# EAGLE schematic Mem Switch V1.1 (EAGLE 9.6.2)

## Sheet 1 of 3: BUS
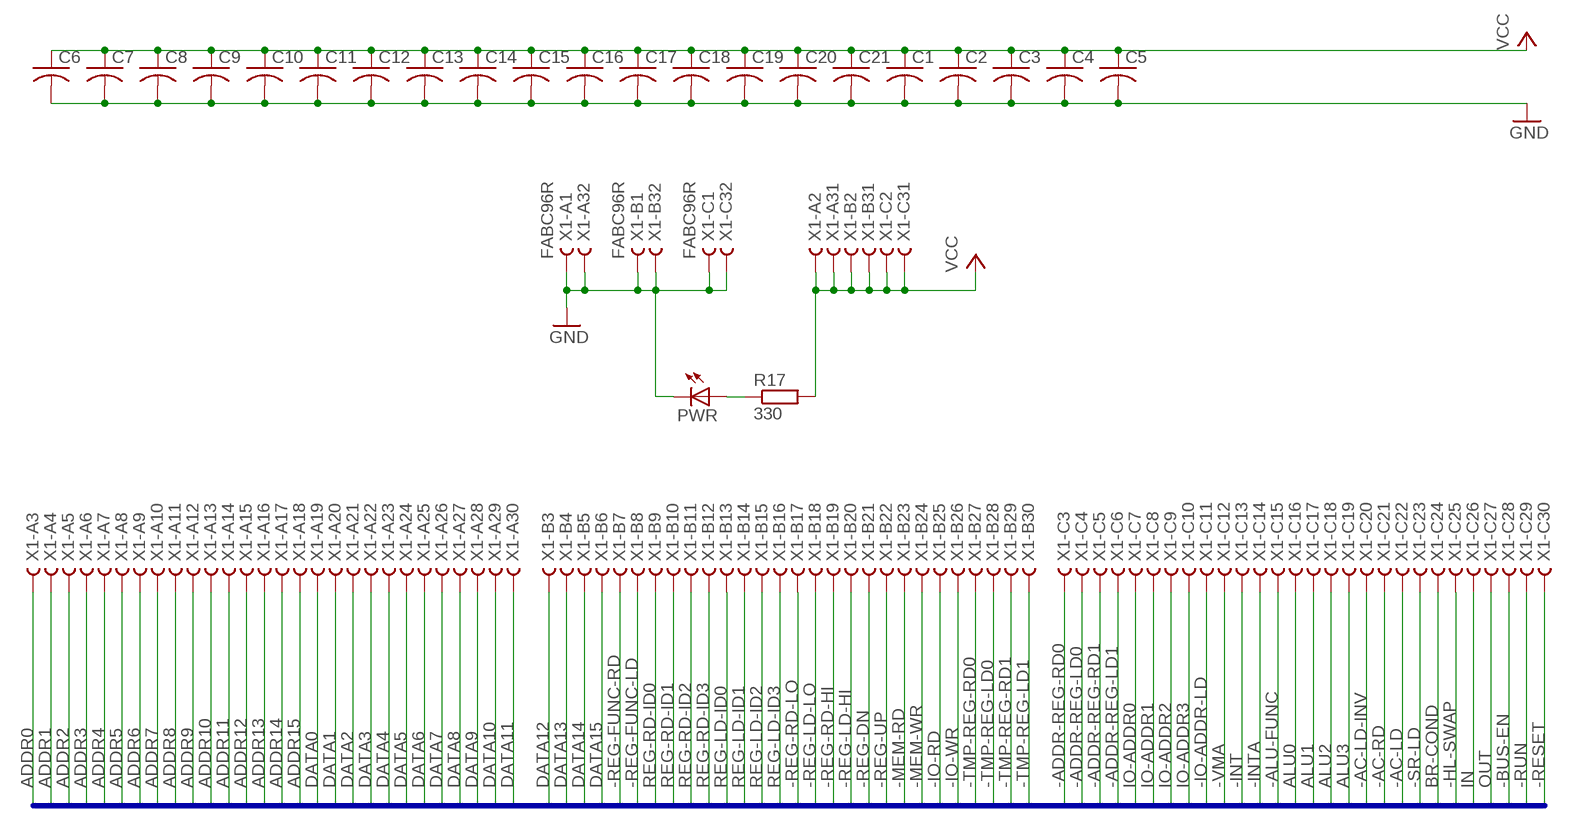
[diagram p0: schematic, sheet 1]

### Parts
C1  C-US025-025X050  [C025-025X050]
C2  C-US025-025X050  [C025-025X050]
C3  C-US025-025X050  [C025-025X050]
C4  C-US025-025X050  [C025-025X050]
C5  C-US025-025X050  [C025-025X050]
C6  C-US025-025X050  [C025-025X050]
C7  C-US025-025X050  [C025-025X050]
C8  C-US025-025X050  [C025-025X050]
C9  C-US025-025X050  [C025-025X050]
C10  C-US025-025X050  [C025-025X050]
C11  C-US025-025X050  [C025-025X050]
C12  C-US025-025X050  [C025-025X050]
C13  C-US025-025X050  [C025-025X050]
C14  C-US025-025X050  [C025-025X050]
C15  C-US025-025X050  [C025-025X050]
C16  C-US025-025X050  [C025-025X050]
C17  C-US025-025X050  [C025-025X050]
C18  C-US025-025X050  [C025-025X050]
C19  C-US025-025X050  [C025-025X050]
C20  C-US025-025X050  [C025-025X050]
C21  C-US025-025X050  [C025-025X050]
PWR  LED5MM  [LED5MM]
R17  330  R0207/10  [0207/10]
X1  FABC96R  [FABC96R]

### Nets
-AC-LD: X1.C22
-AC-LD-INV: X1.C20
-AC-RD: X1.C21
-ADDR-REG-LD0: X1.C4
-ADDR-REG-LD1: X1.C6
-ADDR-REG-RD0: X1.C3
-ADDR-REG-RD1: X1.C5
-ALU-FUNC: X1.C15
-BUS-EN: X1.C28 ; also sheet 3
-HL-SWAP: X1.C25
-INT: X1.C13
-INTA: X1.C14
-IO-ADDR-LD: X1.C11
-IO-RD: X1.B25
-IO-WR: X1.B26
-MEM-RD: X1.B23 ; also sheet 3
-MEM-WR: X1.B24
-REG-DN: X1.B21
-REG-FUNC-LD: X1.B8
-REG-FUNC-RD: X1.B7
-REG-LD-HI: X1.B20
-REG-LD-LO: X1.B18
-REG-RD-HI: X1.B19
-REG-RD-LO: X1.B17
-REG-UP: X1.B22
-RESET: X1.C30
-RUN: X1.C29
-SR-LD: X1.C23
-TMP-REG-LD0: X1.B28
-TMP-REG-LD1: X1.B30
-TMP-REG-RD0: X1.B27
-TMP-REG-RD1: X1.B29
-VMA: X1.C12 ; also sheet 3
ADDR0: X1.A3 ; also sheet 3
ADDR1: X1.A4 ; also sheet 3
ADDR2: X1.A5 ; also sheet 3
ADDR3: X1.A6 ; also sheet 3
ADDR4: X1.A7 ; also sheet 3
ADDR5: X1.A8 ; also sheet 3
ADDR6: X1.A9 ; also sheet 3
ADDR7: X1.A10 ; also sheet 3
ADDR8: X1.A11 ; also sheet 3
ADDR9: X1.A12 ; also sheet 3
ADDR10: X1.A13 ; also sheet 3
ADDR11: X1.A14 ; also sheet 3
ADDR12: X1.A15 ; also sheet 3
ADDR13: X1.A16 ; also sheet 3
ADDR14: X1.A17 ; also sheet 3
ADDR15: X1.A18 ; also sheet 3
ALU0: X1.C16
ALU1: X1.C17
ALU2: X1.C18
ALU3: X1.C19
BR-COND: X1.C24
DATA0: X1.A19 ; also sheet 2
DATA1: X1.A20 ; also sheet 2
DATA2: X1.A21 ; also sheet 2
DATA3: X1.A22 ; also sheet 2
DATA4: X1.A23 ; also sheet 2
DATA5: X1.A24 ; also sheet 2
DATA6: X1.A25 ; also sheet 2
DATA7: X1.A26 ; also sheet 2
DATA8: X1.A27
DATA9: X1.A28
DATA10: X1.A29
DATA11: X1.A30
DATA12: X1.B3
DATA13: X1.B4
DATA14: X1.B5
DATA15: X1.B6
GND: C1.2 C2.2 C3.2 C4.2 C5.2 C6.2 C7.2 C8.2 C9.2 C10.2 C11.2 C12.2 C13.2 C14.2 C15.2 C16.2 C17.2 C18.2 C19.2 C20.2 C21.2 PWR.K(C) X1.A1 X1.A32 X1.B1 X1.B32 X1.C1 X1.C32 ; also sheet 2,3
IN: X1.C26
IO-ADDR0: X1.C7
IO-ADDR1: X1.C8
IO-ADDR2: X1.C9
IO-ADDR3: X1.C10
N$11: PWR.A R17.1
OUT: X1.C27
REG-LD-ID0: X1.B13
REG-LD-ID1: X1.B14
REG-LD-ID2: X1.B15
REG-LD-ID3: X1.B16
REG-RD-ID0: X1.B9
REG-RD-ID1: X1.B10
REG-RD-ID2: X1.B11
REG-RD-ID3: X1.B12
VCC: C1.1 C2.1 C3.1 C4.1 C5.1 C6.1 C7.1 C8.1 C9.1 C10.1 C11.1 C12.1 C13.1 C14.1 C15.1 C16.1 C17.1 C18.1 C19.1 C20.1 C21.1 R17.2 X1.A2 X1.A31 X1.B2 X1.B31 X1.C2 X1.C31 ; also sheet 2,3

### Buses
-AC-LD,-AC-LD-INV,-AC-RD,ADDR[0..15],-ADDR-REG-LD[0..1],-ADDR-REG-RD[0..1],ALU[0..3],-ALU-FUNC,BR-COND,-BUS-EN,DATA[0..15],-HL-SWAP,IN,-INT,-INTA,IO-ADDR[0..3],-IO-ADDR-LD,-IO-RD,-IO-WR,-MEM-RD,-MEM-WR,OUT,-REG-DN,-REG-FUNC-LD,-REG-FUNC-RD,-REG-LD-HI,REG-LD-ID[0..3],-REG-LD-LO,-REG-RD-HI,REG-RD-ID[0..3],-REG-RD-LO,-REG-UP,-RESET,-RUN,-SR-LD,-TMP-REG-LD[0..1],-TMP-REG-RD[0..1],-VMA

## Sheet 2 of 3
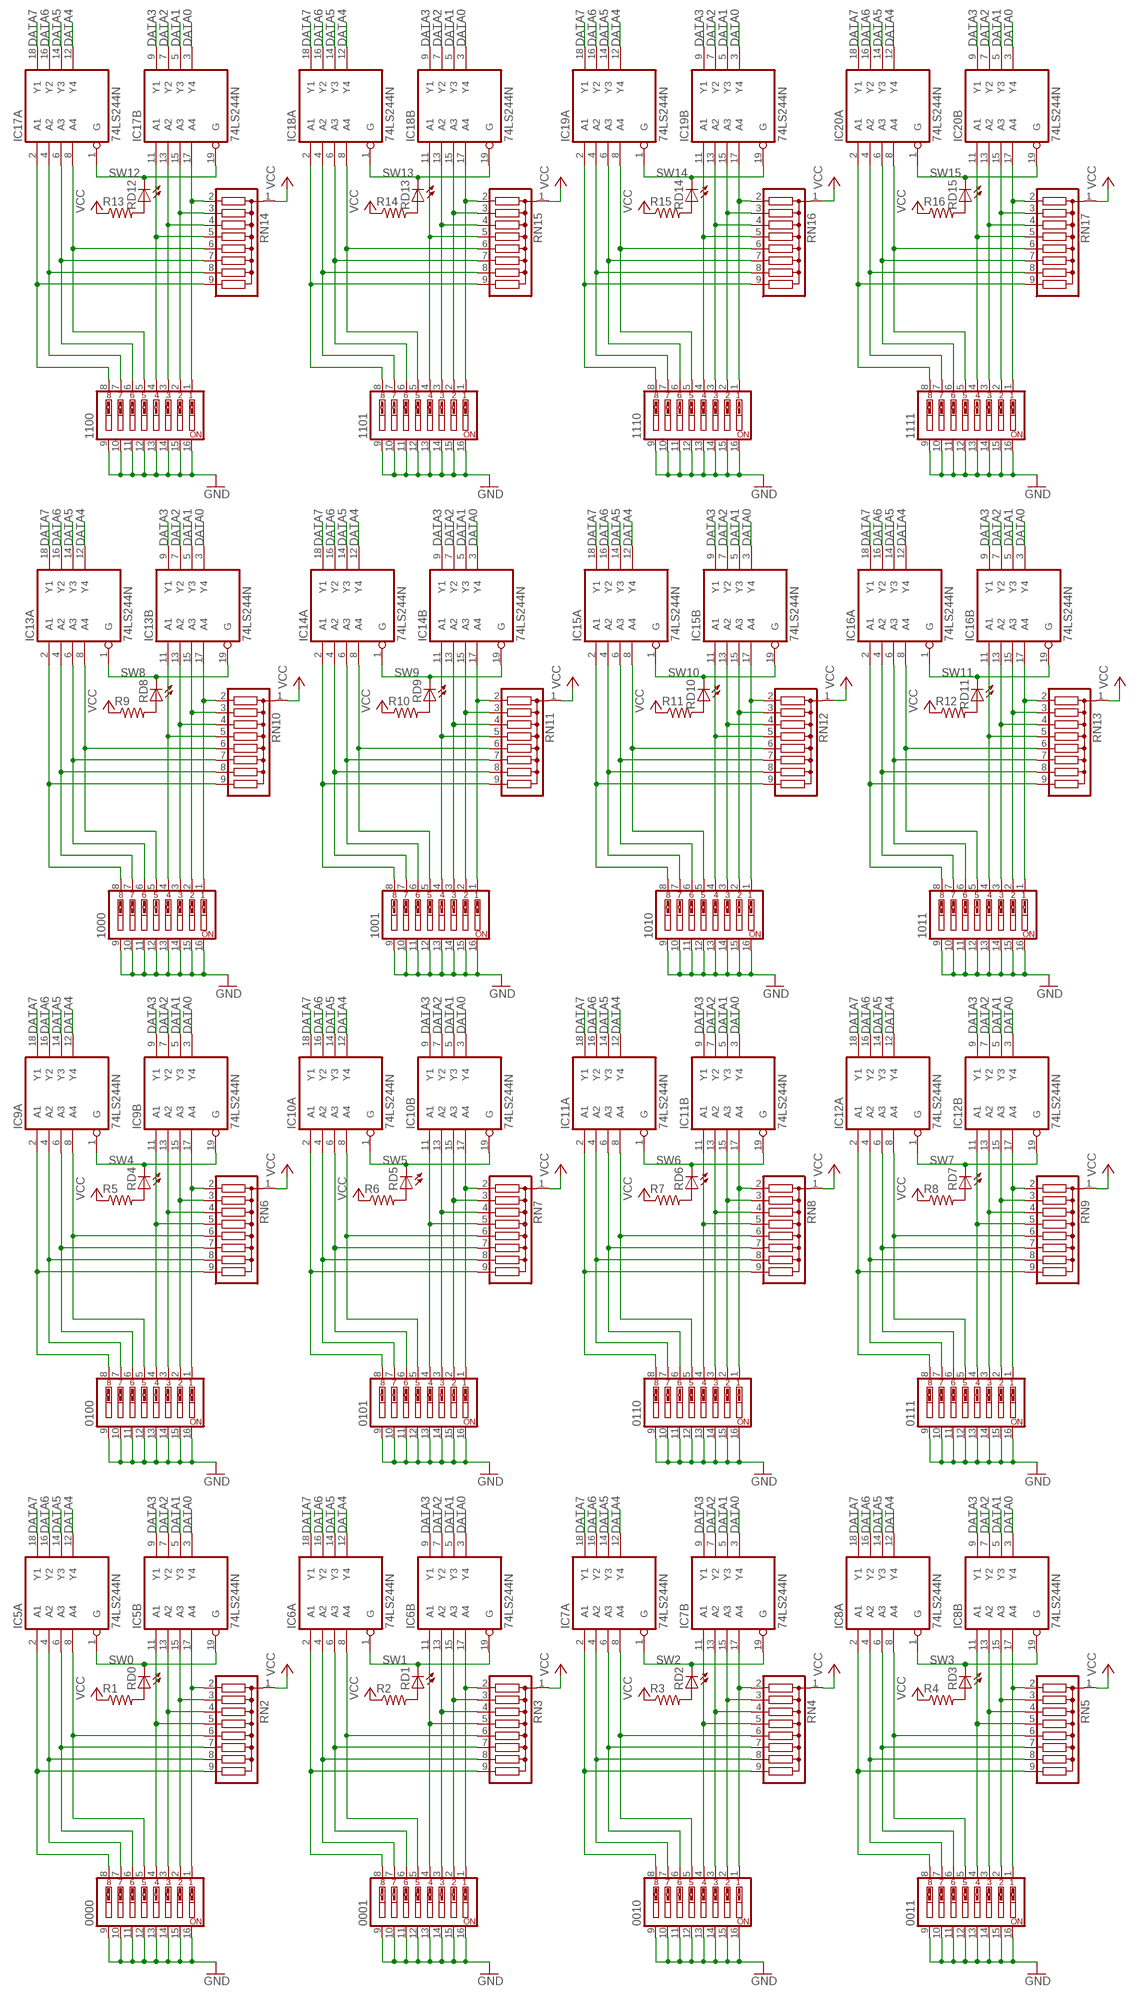
[diagram p1: schematic, sheet 2]

### Parts
0000  SW_DIP-8  [EDG-08]
0001  SW_DIP-8  [EDG-08]
0010  SW_DIP-8  [EDG-08]
0011  SW_DIP-8  [EDG-08]
0100  SW_DIP-8  [EDG-08]
0101  SW_DIP-8  [EDG-08]
0110  SW_DIP-8  [EDG-08]
0111  SW_DIP-8  [EDG-08]
1000  SW_DIP-8  [EDG-08]
1001  SW_DIP-8  [EDG-08]
1010  SW_DIP-8  [EDG-08]
1011  SW_DIP-8  [EDG-08]
1100  SW_DIP-8  [EDG-08]
1101  SW_DIP-8  [EDG-08]
1110  SW_DIP-8  [EDG-08]
1111  SW_DIP-8  [EDG-08]
IC5  74LS244N  [DIL20]
IC6  74LS244N  [DIL20]
IC7  74LS244N  [DIL20]
IC8  74LS244N  [DIL20]
IC9  74LS244N  [DIL20]
IC10  74LS244N  [DIL20]
IC11  74LS244N  [DIL20]
IC12  74LS244N  [DIL20]
IC13  74LS244N  [DIL20]
IC14  74LS244N  [DIL20]
IC15  74LS244N  [DIL20]
IC16  74LS244N  [DIL20]
IC17  74LS244N  [DIL20]
IC18  74LS244N  [DIL20]
IC19  74LS244N  [DIL20]
IC20  74LS244N  [DIL20]
R1  R-US_0207/10  [0207/10]
R2  R-US_0207/10  [0207/10]
R3  R-US_0207/10  [0207/10]
R4  R-US_0207/10  [0207/10]
R5  R-US_0207/10  [0207/10]
R6  R-US_0207/10  [0207/10]
R7  R-US_0207/10  [0207/10]
R8  R-US_0207/10  [0207/10]
R9  R-US_0207/10  [0207/10]
R10  R-US_0207/10  [0207/10]
R11  R-US_0207/10  [0207/10]
R12  R-US_0207/10  [0207/10]
R13  R-US_0207/10  [0207/10]
R14  R-US_0207/10  [0207/10]
R15  R-US_0207/10  [0207/10]
R16  R-US_0207/10  [0207/10]
RD0  LED3MM  [LED3MM]
RD1  LED3MM  [LED3MM]
RD2  LED3MM  [LED3MM]
RD3  LED3MM  [LED3MM]
RD4  LED3MM  [LED3MM]
RD5  LED3MM  [LED3MM]
RD6  LED3MM  [LED3MM]
RD7  LED3MM  [LED3MM]
RD8  LED3MM  [LED3MM]
RD9  LED3MM  [LED3MM]
RD10  LED3MM  [LED3MM]
RD11  LED3MM  [LED3MM]
RD12  LED3MM  [LED3MM]
RD13  LED3MM  [LED3MM]
RD14  LED3MM  [LED3MM]
RD15  LED3MM  [LED3MM]
RN2  G08R  [SIL9]
RN3  G08R  [SIL9]
RN4  G08R  [SIL9]
RN5  G08R  [SIL9]
RN6  G08R  [SIL9]
RN7  G08R  [SIL9]
RN8  G08R  [SIL9]
RN9  G08R  [SIL9]
RN10  G08R  [SIL9]
RN11  G08R  [SIL9]
RN12  G08R  [SIL9]
RN13  G08R  [SIL9]
RN14  G08R  [SIL9]
RN15  G08R  [SIL9]
RN16  G08R  [SIL9]
RN17  G08R  [SIL9]

### Nets
DATA0: IC5.3(B:Y4) IC6.3(B:Y4) IC7.3(B:Y4) IC8.3(B:Y4) IC9.3(B:Y4) IC10.3(B:Y4) IC11.3(B:Y4) IC12.3(B:Y4) IC13.3(B:Y4) IC14.3(B:Y4) IC15.3(B:Y4) IC16.3(B:Y4) IC17.3(B:Y4) IC18.3(B:Y4) IC19.3(B:Y4) IC20.3(B:Y4) ; also sheet 1
DATA1: IC5.5(B:Y3) IC6.5(B:Y3) IC7.5(B:Y3) IC8.5(B:Y3) IC9.5(B:Y3) IC10.5(B:Y3) IC11.5(B:Y3) IC12.5(B:Y3) IC13.5(B:Y3) IC14.5(B:Y3) IC15.5(B:Y3) IC16.5(B:Y3) IC17.5(B:Y3) IC18.5(B:Y3) IC19.5(B:Y3) IC20.5(B:Y3) ; also sheet 1
DATA2: IC5.7(B:Y2) IC6.7(B:Y2) IC7.7(B:Y2) IC8.7(B:Y2) IC9.7(B:Y2) IC10.7(B:Y2) IC11.7(B:Y2) IC12.7(B:Y2) IC13.7(B:Y2) IC14.7(B:Y2) IC15.7(B:Y2) IC16.7(B:Y2) IC17.7(B:Y2) IC18.7(B:Y2) IC19.7(B:Y2) IC20.7(B:Y2) ; also sheet 1
DATA3: IC5.9(B:Y1) IC6.9(B:Y1) IC7.9(B:Y1) IC8.9(B:Y1) IC9.9(B:Y1) IC10.9(B:Y1) IC11.9(B:Y1) IC12.9(B:Y1) IC13.9(B:Y1) IC14.9(B:Y1) IC15.9(B:Y1) IC16.9(B:Y1) IC17.9(B:Y1) IC18.9(B:Y1) IC19.9(B:Y1) IC20.9(B:Y1) ; also sheet 1
DATA4: IC5.12(A:Y4) IC6.12(A:Y4) IC7.12(A:Y4) IC8.12(A:Y4) IC9.12(A:Y4) IC10.12(A:Y4) IC11.12(A:Y4) IC12.12(A:Y4) IC13.12(A:Y4) IC14.12(A:Y4) IC15.12(A:Y4) IC16.12(A:Y4) IC17.12(A:Y4) IC18.12(A:Y4) IC19.12(A:Y4) IC20.12(A:Y4) ; also sheet 1
DATA5: IC5.14(A:Y3) IC6.14(A:Y3) IC7.14(A:Y3) IC8.14(A:Y3) IC9.14(A:Y3) IC10.14(A:Y3) IC11.14(A:Y3) IC12.14(A:Y3) IC13.14(A:Y3) IC14.14(A:Y3) IC15.14(A:Y3) IC16.14(A:Y3) IC17.14(A:Y3) IC18.14(A:Y3) IC19.14(A:Y3) IC20.14(A:Y3) ; also sheet 1
DATA6: IC5.16(A:Y2) IC6.16(A:Y2) IC7.16(A:Y2) IC8.16(A:Y2) IC9.16(A:Y2) IC10.16(A:Y2) IC11.16(A:Y2) IC12.16(A:Y2) IC13.16(A:Y2) IC14.16(A:Y2) IC15.16(A:Y2) IC16.16(A:Y2) IC17.16(A:Y2) IC18.16(A:Y2) IC19.16(A:Y2) IC20.16(A:Y2) ; also sheet 1
DATA7: IC5.18(A:Y1) IC6.18(A:Y1) IC7.18(A:Y1) IC8.18(A:Y1) IC9.18(A:Y1) IC10.18(A:Y1) IC11.18(A:Y1) IC12.18(A:Y1) IC13.18(A:Y1) IC14.18(A:Y1) IC15.18(A:Y1) IC16.18(A:Y1) IC17.18(A:Y1) IC18.18(A:Y1) IC19.18(A:Y1) IC20.18(A:Y1) ; also sheet 1
GND: 0000.9 0000.10 0000.11 0000.12 0000.13 0000.14 0000.15 0000.16 0001.9 0001.10 0001.11 0001.12 0001.13 0001.14 0001.15 0001.16 0010.9 0010.10 0010.11 0010.12 0010.13 0010.14 0010.15 0010.16 0011.9 0011.10 0011.11 0011.12 0011.13 0011.14 0011.15 0011.16 0100.9 0100.10 0100.11 0100.12 0100.13 0100.14 0100.15 0100.16 0101.9 0101.10 0101.11 0101.12 0101.13 0101.14 0101.15 0101.16 0110.9 0110.10 0110.11 0110.12 0110.13 0110.14 0110.15 0110.16 0111.9 0111.10 0111.11 0111.12 0111.13 0111.14 0111.15 0111.16 1000.9 1000.10 1000.11 1000.12 1000.13 1000.14 1000.15 1000.16 1001.9 1001.10 1001.11 1001.12 1001.13 1001.14 1001.15 1001.16 1010.9 1010.10 1010.11 1010.12 1010.13 1010.14 1010.15 1010.16 1011.9 1011.10 1011.11 1011.12 1011.13 1011.14 1011.15 1011.16 1100.9 1100.10 1100.11 1100.12 1100.13 1100.14 1100.15 1100.16 1101.9 1101.10 1101.11 1101.12 1101.13 1101.14 1101.15 1101.16 1110.9 1110.10 1110.11 1110.12 1110.13 1110.14 1110.15 1110.16 1111.9 1111.10 1111.11 1111.12 1111.13 1111.14 1111.15 1111.16 ; also sheet 1,3
N$1: 0000.1 IC5.17(B:A4) RN2.2
N$2: 0000.2 IC5.15(B:A3) RN2.3
N$3: 0000.3 IC5.13(B:A2) RN2.4
N$4: 0000.4 IC5.11(B:A1) RN2.5
N$5: 0000.5 IC5.8(A:A4) RN2.6
N$7: 0000.6 IC5.6(A:A3) RN2.7
N$8: 0000.7 IC5.4(A:A2) RN2.8
N$9: 0000.8 IC5.2(A:A1) RN2.9
N$10: 0001.1 IC6.17(B:A4) RN3.2
N$12: 0001.2 IC6.15(B:A3) RN3.3
N$13: 0001.3 IC6.13(B:A2) RN3.4
N$14: 0001.4 IC6.11(B:A1) RN3.5
N$15: 0001.5 IC6.8(A:A4) RN3.6
N$16: 0001.6 IC6.6(A:A3) RN3.7
N$17: 0001.7 IC6.4(A:A2) RN3.8
N$18: 0001.8 IC6.2(A:A1) RN3.9
N$20: 0010.1 IC7.17(B:A4) RN4.2
N$21: 0010.2 IC7.15(B:A3) RN4.3
N$22: 0010.3 IC7.13(B:A2) RN4.4
N$23: 0010.4 IC7.11(B:A1) RN4.5
N$24: 0010.5 IC7.8(A:A4) RN4.6
N$25: 0010.6 IC7.6(A:A3) RN4.7
N$26: 0010.7 IC7.4(A:A2) RN4.8
N$27: 0010.8 IC7.2(A:A1) RN4.9
N$29: 0011.1 IC8.17(B:A4) RN5.2
N$30: 0011.2 IC8.15(B:A3) RN5.3
N$31: 0011.3 IC8.13(B:A2) RN5.4
N$32: 0011.4 IC8.11(B:A1) RN5.5
N$33: 0011.5 IC8.8(A:A4) RN5.6
N$34: 0011.6 IC8.6(A:A3) RN5.7
N$35: 0011.7 IC8.4(A:A2) RN5.8
N$36: 0011.8 IC8.2(A:A1) RN5.9
N$38: 0100.1 IC9.17(B:A4) RN6.2
N$39: 0100.2 IC9.15(B:A3) RN6.3
N$40: 0100.3 IC9.13(B:A2) RN6.4
N$41: 0100.4 IC9.11(B:A1) RN6.5
N$42: 0100.5 IC9.8(A:A4) RN6.6
N$43: 0100.6 IC9.6(A:A3) RN6.7
N$44: 0100.7 IC9.4(A:A2) RN6.8
N$45: 0100.8 IC9.2(A:A1) RN6.9
N$47: 0101.1 IC10.17(B:A4) RN7.2
N$48: 0101.2 IC10.15(B:A3) RN7.3
N$49: 0101.3 IC10.13(B:A2) RN7.4
N$50: 0101.4 IC10.11(B:A1) RN7.5
N$51: 0101.5 IC10.8(A:A4) RN7.6
N$52: 0101.6 IC10.6(A:A3) RN7.7
N$53: 0101.7 IC10.4(A:A2) RN7.8
N$54: 0101.8 IC10.2(A:A1) RN7.9
N$56: 0110.1 IC11.17(B:A4) RN8.2
N$57: 0110.2 IC11.15(B:A3) RN8.3
N$58: 0110.3 IC11.13(B:A2) RN8.4
N$59: 0110.4 IC11.11(B:A1) RN8.5
N$60: 0110.5 IC11.8(A:A4) RN8.6
N$61: 0110.6 IC11.6(A:A3) RN8.7
N$62: 0110.7 IC11.4(A:A2) RN8.8
N$63: 0110.8 IC11.2(A:A1) RN8.9
N$65: 0111.1 IC12.17(B:A4) RN9.2
N$66: 0111.2 IC12.15(B:A3) RN9.3
N$67: 0111.3 IC12.13(B:A2) RN9.4
N$68: 0111.4 IC12.11(B:A1) RN9.5
N$69: 0111.5 IC12.8(A:A4) RN9.6
N$70: 0111.6 IC12.6(A:A3) RN9.7
N$71: 0111.7 IC12.4(A:A2) RN9.8
N$72: 0111.8 IC12.2(A:A1) RN9.9
N$74: 1000.1 IC13.17(B:A4) RN10.2
N$75: 1000.2 IC13.15(B:A3) RN10.3
N$76: 1000.3 IC13.13(B:A2) RN10.4
N$77: 1000.4 IC13.11(B:A1) RN10.5
N$78: 1000.5 IC13.8(A:A4) RN10.6
N$79: 1000.6 IC13.6(A:A3) RN10.7
N$80: 1000.7 IC13.4(A:A2) RN10.8
N$81: 1000.8 IC13.2(A:A1) RN10.9
N$83: 1001.1 IC14.17(B:A4) RN11.2
N$84: 1001.2 IC14.15(B:A3) RN11.3
N$85: 1001.3 IC14.13(B:A2) RN11.4
N$86: 1001.4 IC14.11(B:A1) RN11.5
N$87: 1001.5 IC14.8(A:A4) RN11.6
N$88: 1001.6 IC14.6(A:A3) RN11.7
N$89: 1001.7 IC14.4(A:A2) RN11.8
N$90: 1001.8 IC14.2(A:A1) RN11.9
N$91: R1.2 RD0.A
N$92: 1010.1 IC15.17(B:A4) RN12.2
N$93: 1010.2 IC15.15(B:A3) RN12.3
N$94: 1010.3 IC15.13(B:A2) RN12.4
N$95: 1010.4 IC15.11(B:A1) RN12.5
N$96: 1010.5 IC15.8(A:A4) RN12.6
N$97: 1010.6 IC15.6(A:A3) RN12.7
N$98: 1010.7 IC15.4(A:A2) RN12.8
N$99: 1010.8 IC15.2(A:A1) RN12.9
N$100: R2.2 RD1.A
N$101: 1011.1 IC16.17(B:A4) RN13.2
N$102: 1011.2 IC16.15(B:A3) RN13.3
N$103: 1011.3 IC16.13(B:A2) RN13.4
N$104: 1011.4 IC16.11(B:A1) RN13.5
N$105: 1011.5 IC16.8(A:A4) RN13.6
N$106: 1011.6 IC16.6(A:A3) RN13.7
N$107: 1011.7 IC16.4(A:A2) RN13.8
N$108: 1011.8 IC16.2(A:A1) RN13.9
N$109: R3.2 RD2.A
N$110: 1100.1 IC17.17(B:A4) RN14.2
N$111: 1100.2 IC17.15(B:A3) RN14.3
N$112: 1100.3 IC17.13(B:A2) RN14.4
N$113: 1100.4 IC17.11(B:A1) RN14.5
N$114: 1100.5 IC17.8(A:A4) RN14.6
N$115: 1100.6 IC17.6(A:A3) RN14.7
N$116: 1100.7 IC17.4(A:A2) RN14.8
N$117: 1100.8 IC17.2(A:A1) RN14.9
N$118: R4.2 RD3.A
N$119: 1101.1 IC18.17(B:A4) RN15.2
N$120: 1101.2 IC18.15(B:A3) RN15.3
N$121: 1101.3 IC18.13(B:A2) RN15.4
N$122: 1101.4 IC18.11(B:A1) RN15.5
N$123: 1101.5 IC18.8(A:A4) RN15.6
N$124: 1101.6 IC18.6(A:A3) RN15.7
N$125: 1101.7 IC18.4(A:A2) RN15.8
N$126: 1101.8 IC18.2(A:A1) RN15.9
N$127: R5.2 RD4.A
N$128: 1110.1 IC19.17(B:A4) RN16.2
N$129: 1110.2 IC19.15(B:A3) RN16.3
N$130: 1110.3 IC19.13(B:A2) RN16.4
N$131: 1110.4 IC19.11(B:A1) RN16.5
N$132: 1110.5 IC19.8(A:A4) RN16.6
N$133: 1110.6 IC19.6(A:A3) RN16.7
N$134: 1110.7 IC19.4(A:A2) RN16.8
N$135: 1110.8 IC19.2(A:A1) RN16.9
N$136: R6.2 RD5.A
N$137: 1111.1 IC20.17(B:A4) RN17.2
N$138: 1111.2 IC20.15(B:A3) RN17.3
N$139: 1111.3 IC20.13(B:A2) RN17.4
N$140: 1111.4 IC20.11(B:A1) RN17.5
N$141: 1111.5 IC20.8(A:A4) RN17.6
N$142: 1111.6 IC20.6(A:A3) RN17.7
N$143: 1111.7 IC20.4(A:A2) RN17.8
N$144: 1111.8 IC20.2(A:A1) RN17.9
N$145: R7.2 RD6.A
N$146: R8.2 RD7.A
N$147: R9.2 RD8.A
N$148: R10.2 RD9.A
N$149: R11.2 RD10.A
N$150: R12.2 RD11.A
N$151: R13.2 RD12.A
N$152: R14.2 RD13.A
N$153: R15.2 RD14.A
N$154: R16.2 RD15.A
SW0: IC5.1(A:G) IC5.19(B:G) RD0.K(C) ; also sheet 3
SW1: IC6.1(A:G) IC6.19(B:G) RD1.K(C) ; also sheet 3
SW2: IC7.1(A:G) IC7.19(B:G) RD2.K(C) ; also sheet 3
SW3: IC8.1(A:G) IC8.19(B:G) RD3.K(C) ; also sheet 3
SW4: IC9.1(A:G) IC9.19(B:G) RD4.K(C) ; also sheet 3
SW5: IC10.1(A:G) IC10.19(B:G) RD5.K(C) ; also sheet 3
SW6: IC11.1(A:G) IC11.19(B:G) RD6.K(C) ; also sheet 3
SW7: IC12.1(A:G) IC12.19(B:G) RD7.K(C) ; also sheet 3
SW8: IC13.1(A:G) IC13.19(B:G) RD8.K(C) ; also sheet 3
SW9: IC14.1(A:G) IC14.19(B:G) RD9.K(C) ; also sheet 3
SW10: IC15.1(A:G) IC15.19(B:G) RD10.K(C) ; also sheet 3
SW11: IC16.1(A:G) IC16.19(B:G) RD11.K(C) ; also sheet 3
SW12: IC17.1(A:G) IC17.19(B:G) RD12.K(C) ; also sheet 3
SW13: IC18.1(A:G) IC18.19(B:G) RD13.K(C) ; also sheet 3
SW14: IC19.1(A:G) IC19.19(B:G) RD14.K(C) ; also sheet 3
SW15: IC20.1(A:G) IC20.19(B:G) RD15.K(C) ; also sheet 3
VCC: R1.1 R2.1 R3.1 R4.1 R5.1 R6.1 R7.1 R8.1 R9.1 R10.1 R11.1 R12.1 R13.1 R14.1 R15.1 R16.1 RN2.1 RN3.1 RN4.1 RN5.1 RN6.1 RN7.1 RN8.1 RN9.1 RN10.1 RN11.1 RN12.1 RN13.1 RN14.1 RN15.1 RN16.1 RN17.1 ; also sheet 1,3

## Sheet 3 of 3
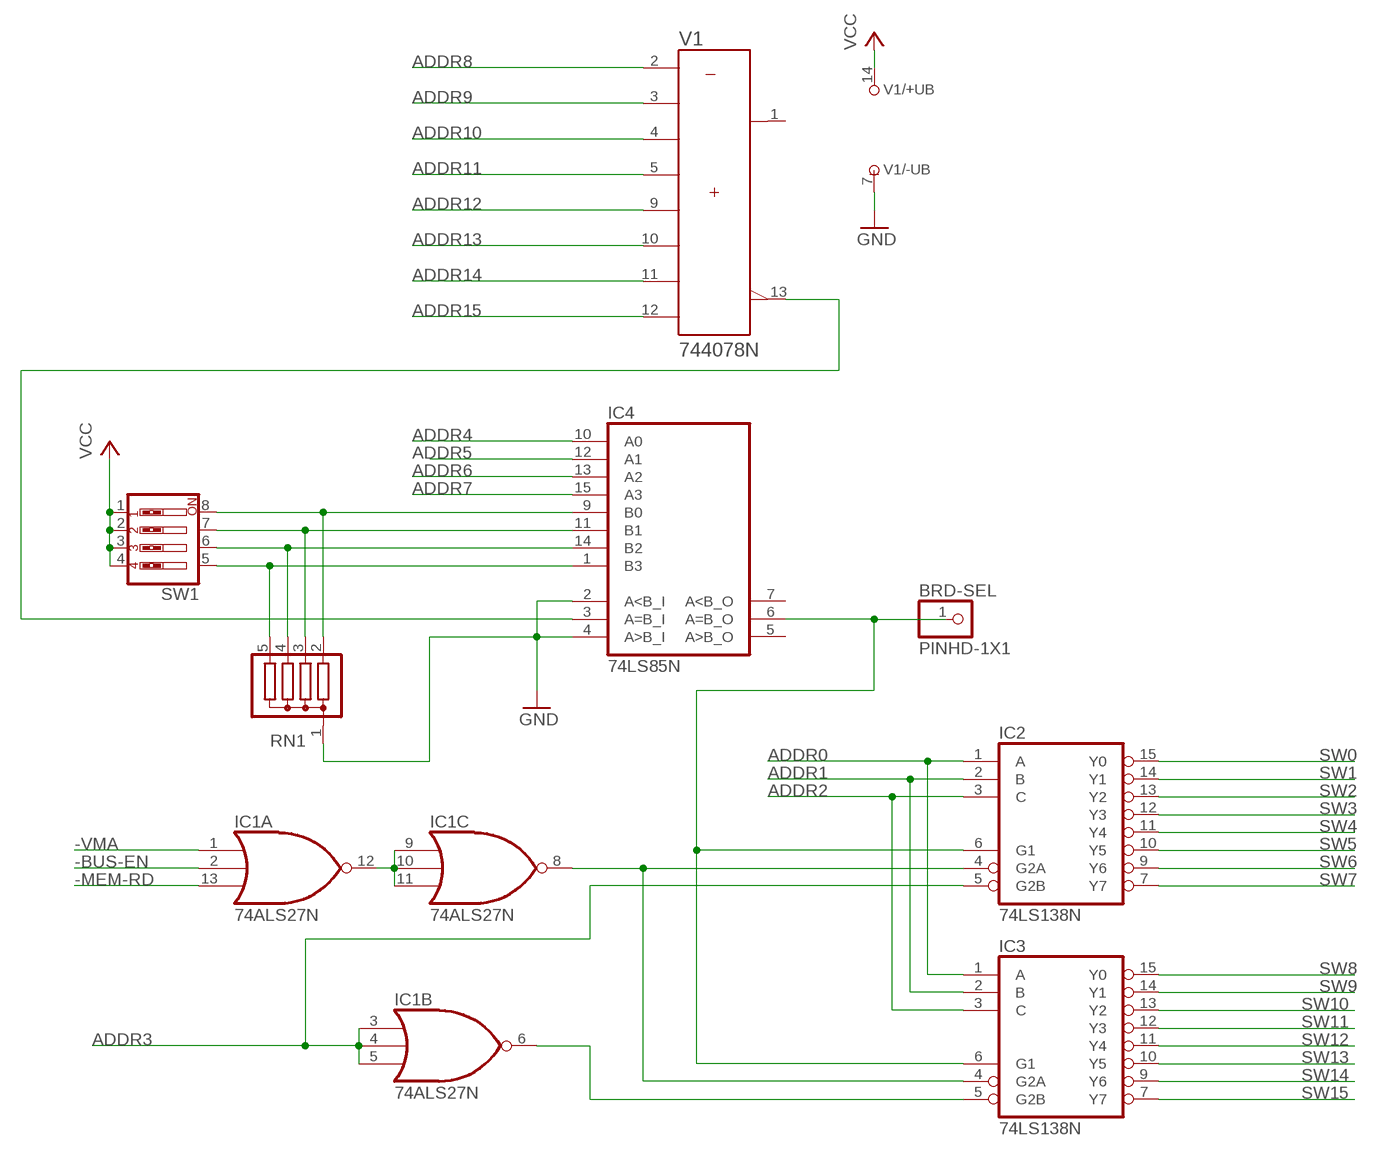
[diagram p2: schematic, sheet 3]

### Parts
BRD-SEL  PINHD-1X1  [1X01]
IC1  74ALS27N  [DIL14]
IC2  74LS138N  [DIL16]
IC3  74LS138N  [DIL16]
IC4  74LS85N  [DIL16]
RN1  G04R  [SIL5]
SW1  SW_DIP-4  [EDG-04]
V1  744078N  [DIL14]

### Nets
-BUS-EN: IC1.2(A:I1) ; also sheet 1
-MEM-RD: IC1.13(A:I2) ; also sheet 1
-VMA: IC1.1(A:I0) ; also sheet 1
ADDR0: IC2.1(A) IC3.1(A) ; also sheet 1
ADDR1: IC2.2(B) IC3.2(B) ; also sheet 1
ADDR2: IC2.3(C) IC3.3(C) ; also sheet 1
ADDR3: IC1.3(B:I0) IC1.4(B:I1) IC1.5(B:I2) IC2.5(G2B) ; also sheet 1
ADDR4: IC4.10(A0) ; also sheet 1
ADDR5: IC4.12(A1) ; also sheet 1
ADDR6: IC4.13(A2) ; also sheet 1
ADDR7: IC4.15(A3) ; also sheet 1
ADDR8: V1.2(A) ; also sheet 1
ADDR9: V1.3(B) ; also sheet 1
ADDR10: V1.4(C) ; also sheet 1
ADDR11: V1.5(D) ; also sheet 1
ADDR12: V1.9(E) ; also sheet 1
ADDR13: V1.10(F) ; also sheet 1
ADDR14: V1.11(G) ; also sheet 1
ADDR15: V1.12(H) ; also sheet 1
GND: IC4.2(A<B_I) IC4.4(A>B_I) RN1.1 V1.7(-UB) ; also sheet 1,2
N$6: BRD-SEL.1 IC2.6(G1) IC3.6(G1) IC4.6(A=B_O)
N$19: IC1.9(C:I0) IC1.10(C:I1) IC1.11(C:I2) IC1.12(A:O)
N$28: IC4.9(B0) RN1.2 SW1.8
N$37: IC1.6(B:O) IC3.5(G2B)
N$46: IC4.11(B1) RN1.3 SW1.7
N$55: IC4.3(A=B_I) V1.13(W)
N$64: IC4.14(B2) RN1.4 SW1.6
N$73: IC4.1(B3) RN1.5 SW1.5
N$82: IC1.8(C:O) IC2.4(G2A) IC3.4(G2A)
SW0: IC2.15(Y0) ; also sheet 2
SW1: IC2.14(Y1) ; also sheet 2
SW2: IC2.13(Y2) ; also sheet 2
SW3: IC2.12(Y3) ; also sheet 2
SW4: IC2.11(Y4) ; also sheet 2
SW5: IC2.10(Y5) ; also sheet 2
SW6: IC2.9(Y6) ; also sheet 2
SW7: IC2.7(Y7) ; also sheet 2
SW8: IC3.15(Y0) ; also sheet 2
SW9: IC3.14(Y1) ; also sheet 2
SW10: IC3.13(Y2) ; also sheet 2
SW11: IC3.12(Y3) ; also sheet 2
SW12: IC3.11(Y4) ; also sheet 2
SW13: IC3.10(Y5) ; also sheet 2
SW14: IC3.9(Y6) ; also sheet 2
SW15: IC3.7(Y7) ; also sheet 2
VCC: SW1.1 SW1.2 SW1.3 SW1.4 V1.14(+UB) ; also sheet 1,2
Unconnected: IC4.5(A>B_O) IC4.7(A<B_O) V1.1(Y)

## Power pins joined to a net without a drawn wire
GND: IC1.7(P:GND) IC2.8(GND) IC3.8(GND) IC4.8(GND) IC5.10(P:GND) IC6.10(P:GND) IC7.10(P:GND) IC8.10(P:GND) IC9.10(P:GND) IC10.10(P:GND) IC11.10(P:GND) IC12.10(P:GND) IC13.10(P:GND) IC14.10(P:GND) IC15.10(P:GND) IC16.10(P:GND) IC17.10(P:GND) IC18.10(P:GND) IC19.10(P:GND) IC20.10(P:GND)
VCC: IC1.14(P:VCC) IC2.16(VCC) IC3.16(VCC) IC4.16(VCC) IC5.20(P:VCC) IC6.20(P:VCC) IC7.20(P:VCC) IC8.20(P:VCC) IC9.20(P:VCC) IC10.20(P:VCC) IC11.20(P:VCC) IC12.20(P:VCC) IC13.20(P:VCC) IC14.20(P:VCC) IC15.20(P:VCC) IC16.20(P:VCC) IC17.20(P:VCC) IC18.20(P:VCC) IC19.20(P:VCC) IC20.20(P:VCC)

## Library data of the parts
0000 0001 0010 0011 0100 0101 0110 0111 1000 1001 1010 1011 1100 1101 1110 1111 = special:SW_DIP-8: DIP SWITCH
BRD-SEL = Connector:PINHD-1X1: PIN HEADER; CATEGORY: CONNECTOR; SUB-CATEGORY: PIN-HEADER
C1-C21 = rcl:C-US: CAPACITOR, American symbol; SPICEPREFIX: C
IC1 = 74xx-us:74*27: Triple 3-input NOR gate
IC2 IC3 = 74xx-us:74*138: 3-line to 8-line DECODER/DEMULTIPLEXER
IC4 = 74xx-us:74*85: 4-bit magnitude COMPARATOR
IC5-IC20 = 74xx-us:74*244: Octal BUFFER and LINE DRIVER, 3-state
PWR = led:LED: LED
R1-R16 = adafruit:R-US_: RESISTOR, American symbol
R17 = eagle-ltspice:R: RESISTOR, European symbol; SPICEMODEL: NONE; SPICEPREFIX: R
RD0 RD1-RD15 = adafruit:LED: LED
RN1 = resistor-sil:G04R: SIL RESISTOR; OC_FARNELL: unknown; OC_NEWARK: unknown
RN2-RN17 = resistor-sil:G08R: SIL RESISTOR; OC_FARNELL: unknown; OC_NEWARK: unknown
SW1 = special:SW_DIP-4: DIP SWITCH
V1 = 74ttl-din:74*4078: 8-input OR/NOR, complementary outputs
X1 = con-vg:FABC96R: CONNECTOR female, 96 pins, type R, rows ABC, grid 2.54 mm

## Net classes
1 GND: width 1 mm
2 5V: width 1 mm